# EAGLE design TPS84320_5V_3P3V (EAGLE 6.3)
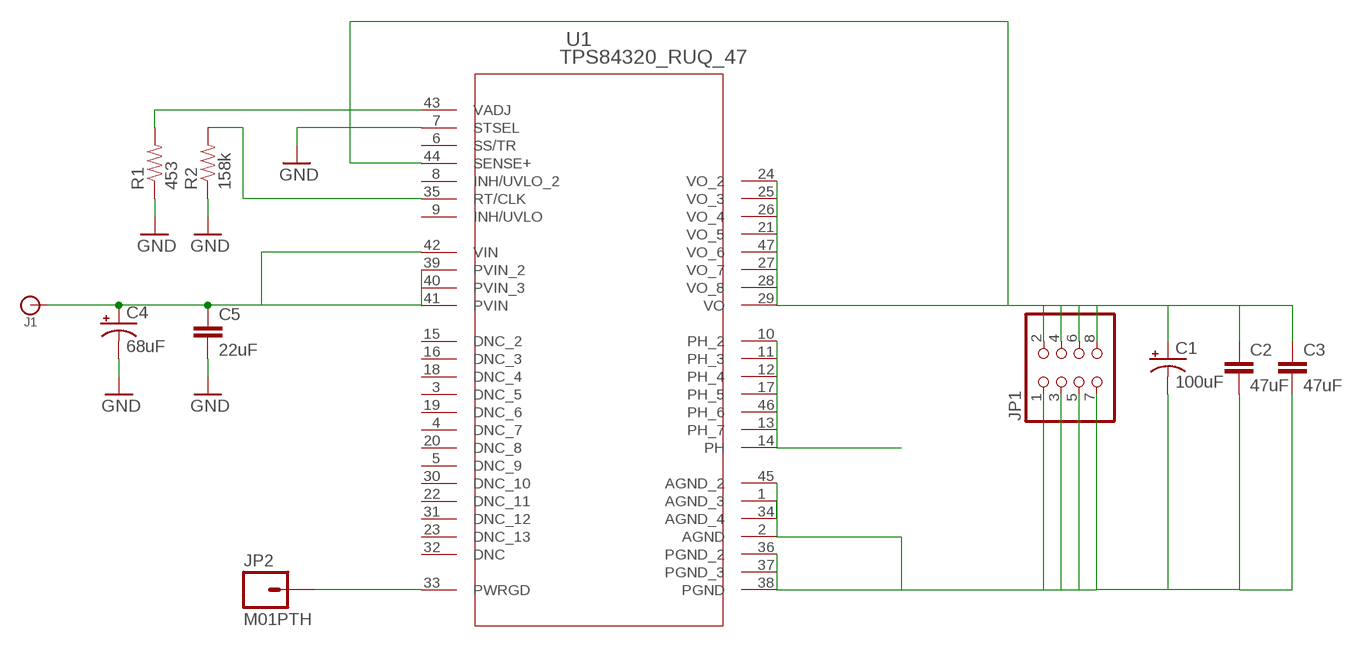
[diagram p0: schematic, sheet 1]

## Parts
C1  100uF  CAP_POL1206  [EIA3216]
C2  47uF  CAP0603-CAP  [0603-CAP]
C3  47uF  CAP0603-CAP  [0603-CAP]
C4  68uF  CAP_POL1206  [EIA3216]
C5  22uF  CAP0603-CAP  [0603-CAP]
J1  BANANA_CONN  [BANANA_CONN]
JP1  PINHD-2X4  [2X04]
JP2  M01PTH  [1X01]
R1  453  RESISTOR0603-RES  [0603-RES]
R2  158k  RESISTOR0603-RES  [0603-RES]
U1  TPS84320_RUQ_47  [RUQ_47]

## Nets
GND: C4.C(-) C5.2 JP1.1 JP1.3 JP1.5 JP1.7 R1.1 R2.1 U1.1(AGND_3) U1.2(AGND) U1.7(STSEL) U1.34(AGND_4) U1.36(PGND_2) U1.37(PGND_3) U1.38(PGND) U1.45(AGND_2)
N$1: JP2.1 U1.33(PWRGD)
N$2: U1.10(PH_2) U1.11(PH_3) U1.12(PH_4) U1.13(PH_7) U1.14(PH) U1.17(PH_5) U1.46(PH_6)
N$3: C1.A(+) C2.1 C3.1 JP1.2 JP1.4 JP1.6 JP1.8 U1.21(VO_5) U1.24(VO_2) U1.25(VO_3) U1.26(VO_4) U1.27(VO_7) U1.28(VO_8) U1.29(VO) U1.44(SENSE+) U1.47(VO_6)
N$4: C4.A(+) C5.1 J1.P$1 U1.39(PVIN_2) U1.40(PVIN_3) U1.41(PVIN) U1.42(VIN)
N$7: R1.2 U1.43(VADJ)
N$8: R2.2 U1.35(RT/CLK)
N$9: C1.C(-) C2.2 C3.2
Unconnected: U1.3(DNC_5) U1.4(DNC_7) U1.5(DNC_9) U1.6(SS/TR) U1.8(INH/UVLO_2) U1.9(INH/UVLO) U1.15(DNC_2) U1.16(DNC_3) U1.18(DNC_4) U1.19(DNC_6) U1.20(DNC_8) U1.22(DNC_11) U1.23(DNC_13) U1.30(DNC_10) U1.31(DNC_12) U1.32(DNC)

## Library data of the parts
C1 C4 = 1x05smd:CAP_POL: Capacitor Polarized These are standard SMD and PTH capacitors. Normally 10uF, 47uF, and 100uF in electrolytic and tantalum varieties. Always verify the external diameter of the through hole cap, it varies with capacity, voltage, and manufacturer. The EIA devices should be standard.
C2 C3 C5 = 1x05smd:CAP: Capacitor Standard 0603 ceramic capacitor, and 0.1" leaded capacitor.
J1 = SparkFun-Connectors:BANANA_CONN: Through-hole banana jack
JP1 = adafruit:PINHD-2X4: PIN HEADER
JP2 = 1x05smd:M01: Header 1 Standard 1-pin 0.1" header. Use with straight break away headers (SKU : PRT-00116), right angle break away headers (PRT-00553), swiss pins (PRT-00743), machine pins (PRT-00117), and female headers (PRT-00115).
R1 R2 = 1x05smd:RESISTOR: Resistor Basic schematic elements and footprints for 0603, 1206, and PTH 1/10th watt (small) resistors.
U1 = Strutz Electronic Industries:TPS84320_RUQ_47; MANUFACTURER_PART_NUMBER: tps84320_ruq_47; VENDOR: TEXAS INSTRUMENTS

## Board
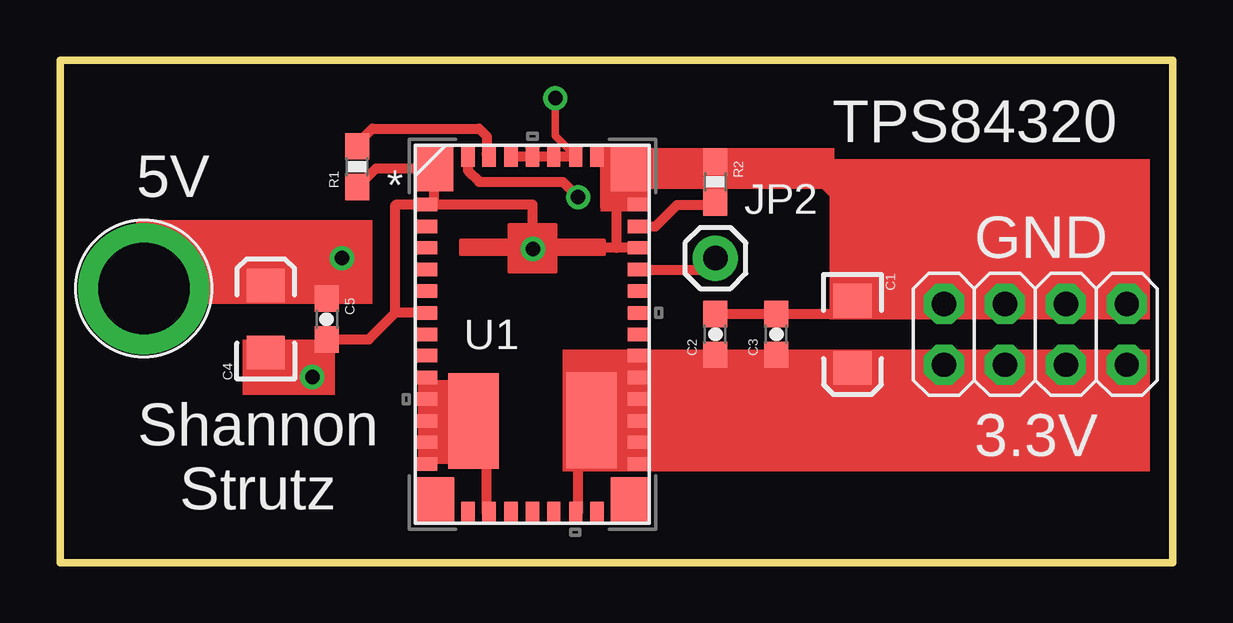
[diagram p1: board, top side]
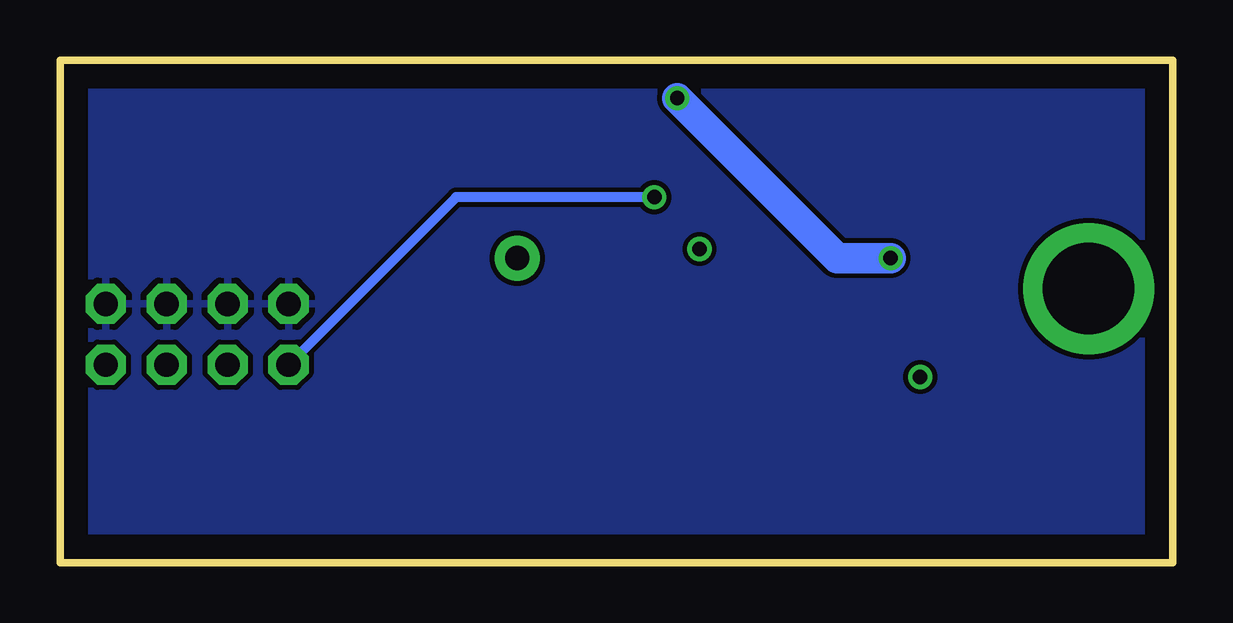
[diagram p2: board, bottom side, seen from below]

Size 46.35 x 20.96 mm. Coordinates in mm from the lower left corner, seen from the top.
Outline: 0,0 46.35,0 46.35,20.96 0,20.96 0,0
Copper layers (1*16): Top 0.035mm / dielectric 1.5mm / Bottom 0.035mm
Design rules "default": minimum track width 10mil, minimum drill 24mil, track to track 8mil, track to pad 8mil, pad to pad 8mil, via to via 8mil, smd to smd 8mil, copper to edge 40mil, drill to drill 8mil, minimum pad ring 10mil, minimum via ring 8mil, stop-mask expansion 4mil, vias tented up to drill 0mil, thermal gap 10mil

### Footprints (pad centres in the part's own frame; a part is rotated, then mirrored left to right if it is on the bottom)
EIA3216 = smd 1.4 x 1.6: A 1.4,0; C -1.4,0
0603-CAP = smd 1.1 x 1: 1 -0.85,0; 2 0.85,0
BANANA_CONN = drill 3.81 pad 5.461: P$1 0,0
2X04 = drill 1.016 pad 1.676 octagon: 1 -3.81,-1.27; 2 -3.81,1.27; 3 -1.27,-1.27; 4 -1.27,1.27; 5 1.27,-1.27; 6 1.27,1.27; 7 3.81,-1.27; 8 3.81,1.27
1X01 = drill 1.016 pad 1.88: 1 0,0
0603-RES = smd 1.1 x 1: 1 -0.85,0; 2 0.85,0
RUQ_47 = smd 1.6 x 1.905: 1 -4.089,6.909; 15 -4.064,-6.909; 23 4.064,-6.909; 37 4.064,6.909 | smd 0.889 x 0.559: 2 -4.42,5.41; 3 -4.42,4.496; 4 -4.42,3.607; 5 -4.42,2.692; 6 -4.42,1.803; 7 -4.42,0.889; 8 -4.42,0; 9 -4.42,-0.889; 10 -4.42,-1.803; 11 -4.42,-2.692; 12 -4.42,-3.607; 13 -4.42,-4.496; 14 -4.42,-5.41; 24 4.42,-5.41; 25 4.42,-4.496; 26 4.42,-3.607; 27 4.42,-2.692; 28 4.42,-1.803; 29 4.42,-0.889; 30 4.42,0; 31 4.42,0.889; 32 4.42,1.803; 33 4.42,2.692; 34 4.42,3.607; 35 4.42,4.496; 36 4.42,5.41 | smd 0.559 x 0.889: 16 -2.692,-7.417; 17 -1.803,-7.417; 18 -0.889,-7.417; 19 0,-7.417; 20 0.889,-7.417; 21 1.803,-7.417; 22 2.692,-7.417; 38 2.692,7.417; 39 1.803,7.417; 40 0.889,7.417; 41 0,7.417; 42 -0.889,7.417; 43 -1.803,7.417; 44 -2.692,7.417 | smd 0.102 x 0.102: 45 0,3.581 | smd 2.108 x 3.988: 46 -2.464,-3.607; 47 2.464,-3.581

### Placement (x,y rotation side)
C1  33.02,9.53 270 top
C2  27.3,9.53 90 top
C3  29.84,9.53 90 top
C4  8.57,10.16 90 top
C5  11.11,10.16 270 top
J1  3.49,11.43 0 top
JP1  40.64,9.53 180 top
JP2  27.3,12.7 0 top
R1  12.38,16.51 90 top
R2  27.3,15.88 270 top
U1  19.68,9.53 0 top

### Tracks (layer width: path | path; a pad name or v marks a point on that pad's centre or on a via)
GND
  Top 0.406: U1.38 23.75,16.94 U1.37 24.11,16.43 | 24.11,16.43 U1.36 23.18,14.94 23.18,13.13 U1.34 19.68,13.13 U1.45 19.68,14.94 U1.2 | U1.2 15.6,14.94 U1.1 13.16,16.43 R1.1 | U1.2 15.25,14.92 13.97,14.92 13.97,10.41 | U1.7 13.97,10.41 | 24.11,16.43 27.01,16.43 R2.1 30.9,16.73 JP1.7 JP1.5 JP1.3 JP1.1 | C4.C 10.56,8.76 C5.2 12.87,9.31 13.97,10.41
  pour Bottom: 0,0 46.35,0 46.35,20.96 0,20.96
N$1
  Top 0.406: U1.33 27.3,12.22 JP2.1
N$2
  Top 0.406: U1.17 17.78,2.11 17.78,5.71 17.22,5.71 U1.46 U1.12 | U1.14 U1.13 U1.12 | U1.12 U1.11 U1.10
N$3  (via drill 0.6)
  Top 0.406: U1.21 21.59,2.11 21.59,6.35 22.15,6.35 U1.47 22.15,5.92 U1.26 | U1.24 U1.25 U1.26 | U1.26 U1.27 U1.28 U1.29 27.3,8.64 C2.1 C3.1 33.02,8.67 C1.A 36.83,8.12 JP1.8 JP1.6 JP1.4 JP1.2 | U1.44 16.99,16.35 17.46,15.88 20.95,15.88 v21.59,15.24
  Bottom 0.406: v21.59,15.24 29.84,15.24 JP1.8
N$4  (via drill 0.6)
  Top 0.305: v20.64,19.37 20.64,17.79 U1.39
  Top 0.406: U1.42 U1.41 U1.40 U1.39 | J1.P$1 8.44,11.43 C4.A 10.56,11.56 C5.1 11.11,12.06 v11.75,12.7
  Bottom 1.27: v11.75,12.7 13.97,12.7 v20.64,19.37
N$5  (via drill 0.6)
  other vias: 19.71,13.08
N$6  (via drill 0.6)
  other vias: 10.52,7.75
N$7
  Top 0.406: R1.2 12.38,17.46 13.02,18.1 17.46,18.1 17.78,17.78 17.78,17.04 U1.43
N$8
  Top 0.406: U1.35 24.82,14.02 25.72,14.92 27.2,14.92 R2.2
N$9
  Top 0.406: C2.2 C3.2 32.47,10.38 C1.C
(copper drawn outside any net)
  shapes: Top area x13

### Text on the board
_tsilk: TPS84320 | 5V | GND | Shannon / Strutz | 3.3V